# Altium project Submarine.PrjPcb
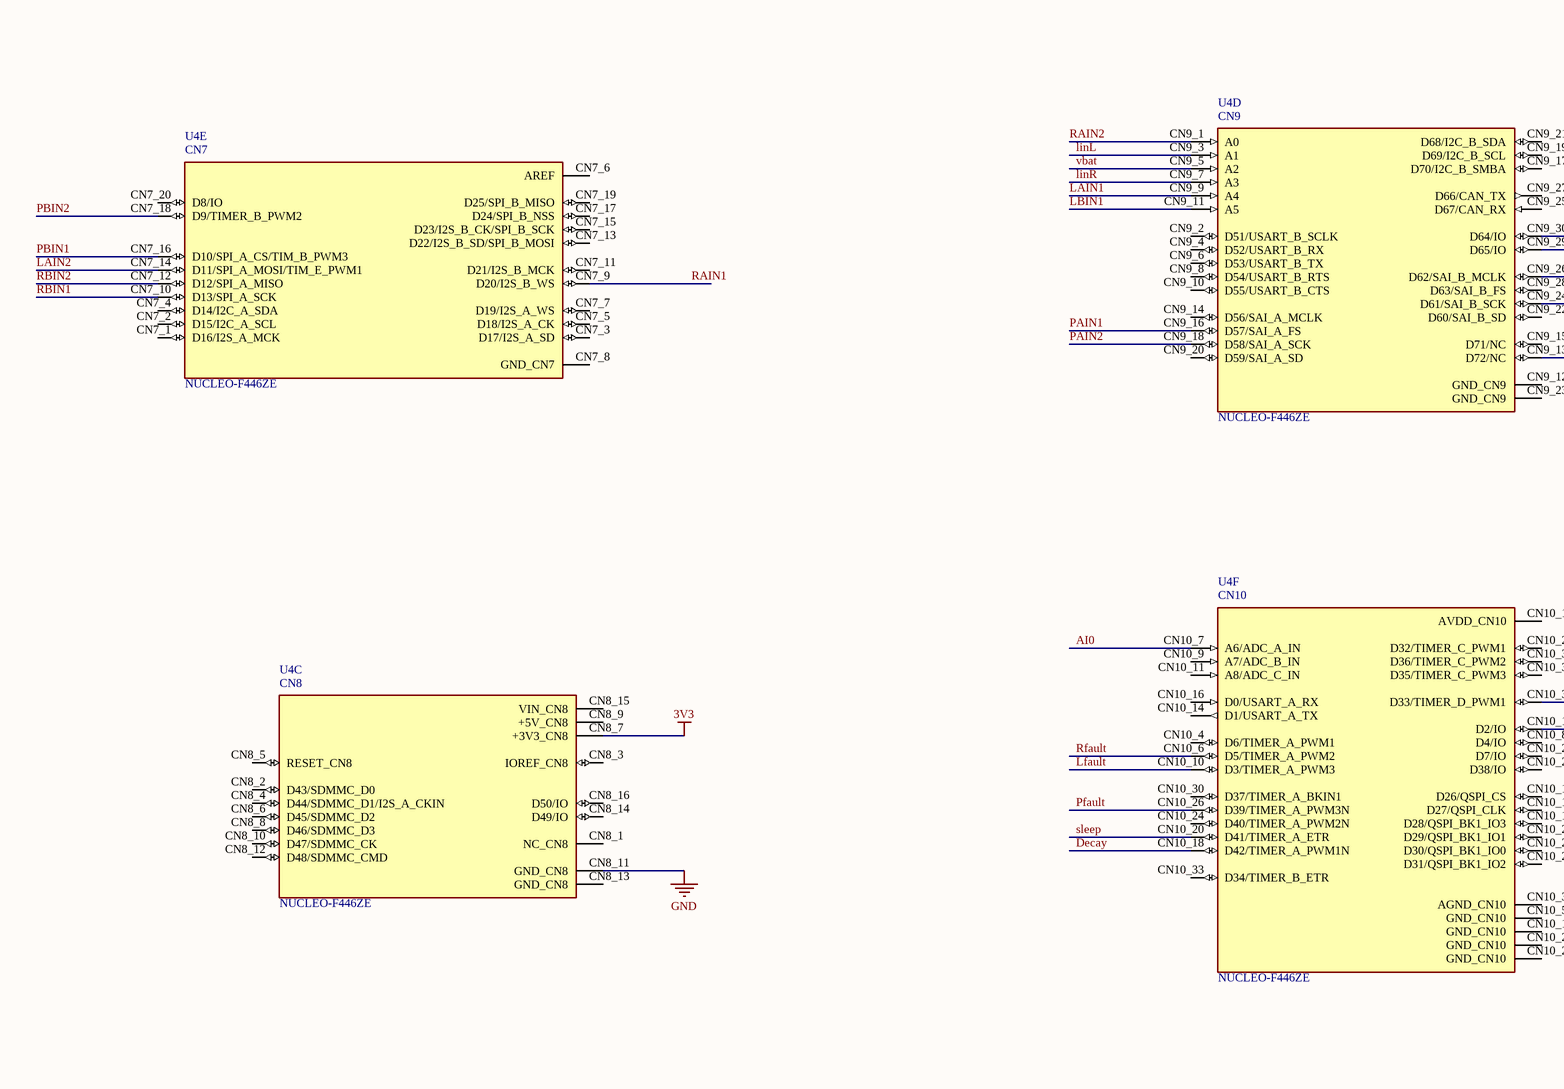
[diagram p0: Submarine.SchDoc, top left]
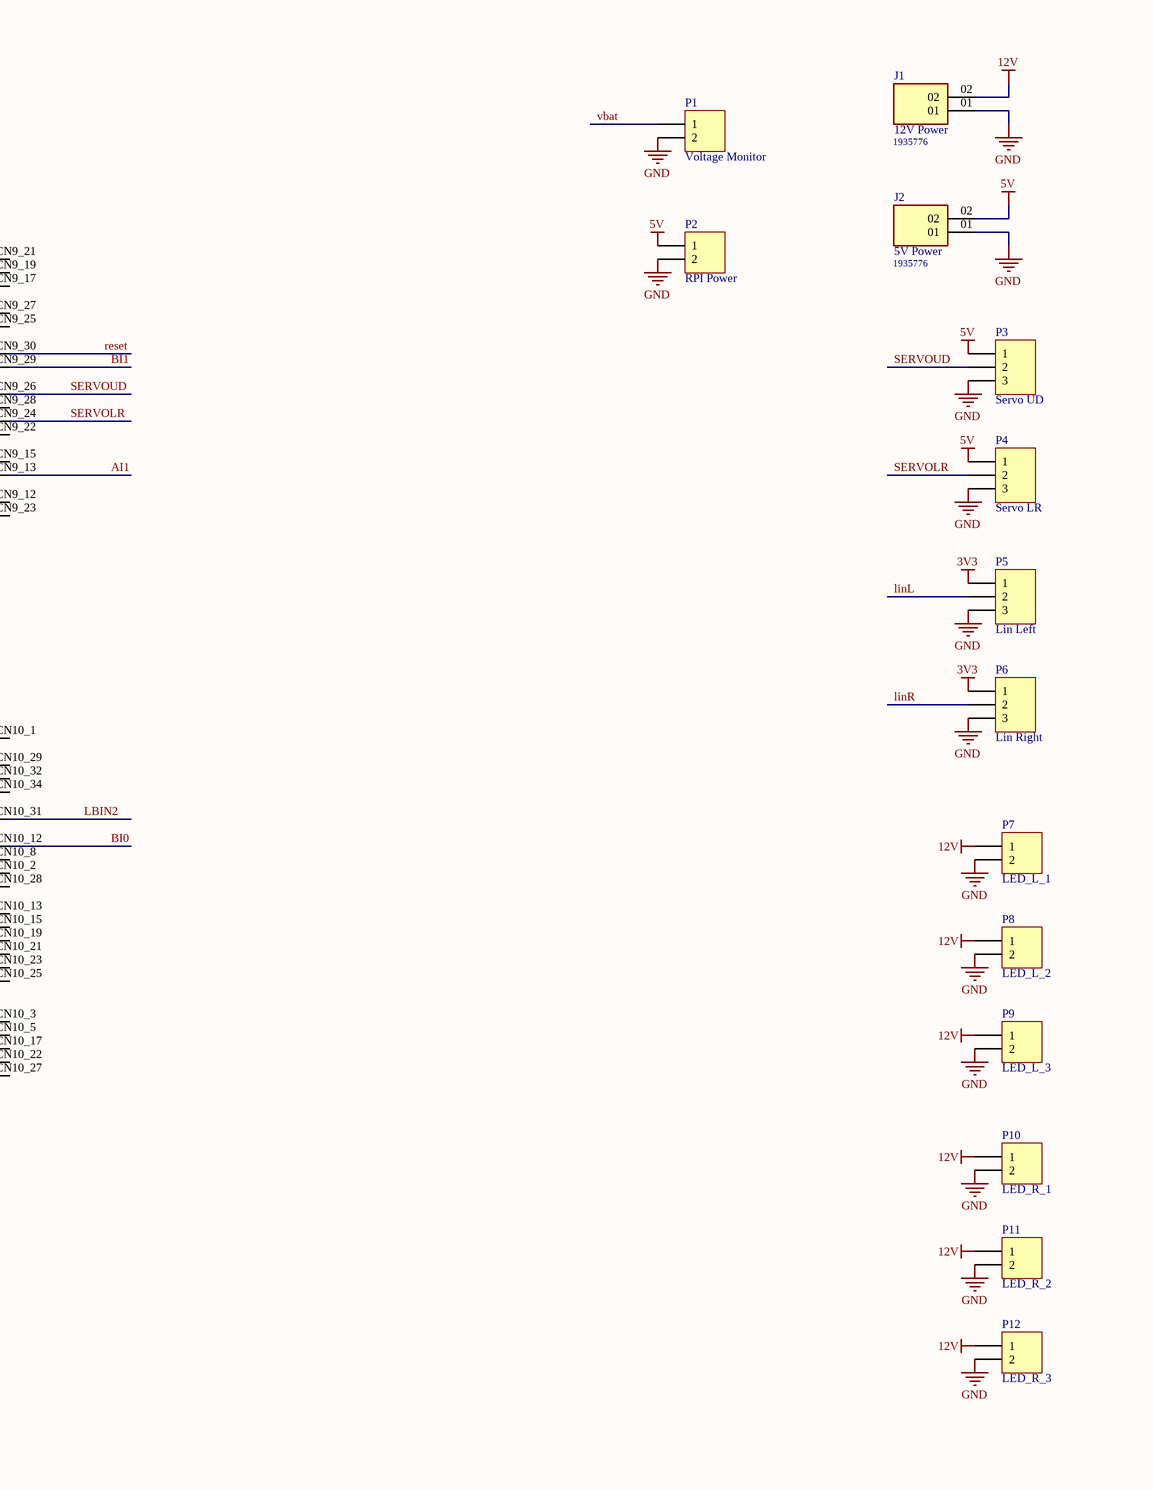
[diagram p1: Submarine.SchDoc, top middle]
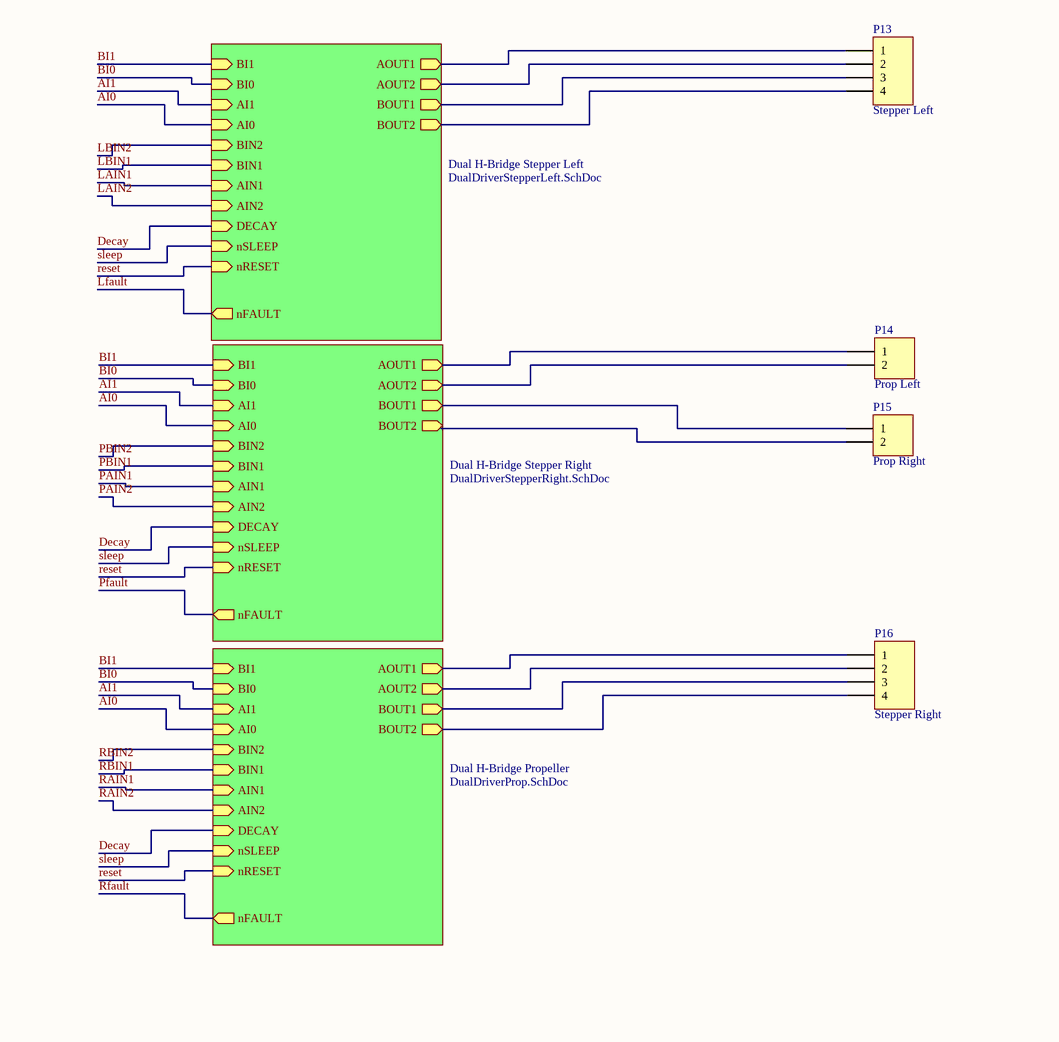
[diagram p2: Submarine.SchDoc, bottom middle]
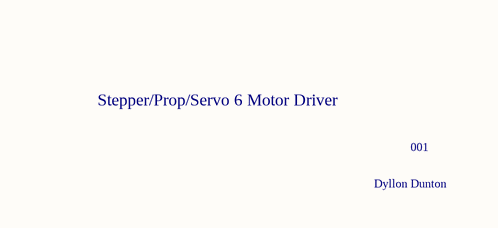
[diagram p3: Submarine.SchDoc, bottom right]
4 sheets, 49 parts. Net scope: hierarchical (ports join the sheet entries above them; power ports are global).
Board file: Submarine.PcbDoc
Sheets:
  Submarine.SchDoc
    Dual H-Bridge Stepper Left = DualDriverStepperLeft.SchDoc
    Dual H-Bridge Stepper Right = DualDriverStepperRight.SchDoc
    Dual H-Bridge Propeller = DualDriverProp.SchDoc

## Sheet Submarine.SchDoc
size E

### Parts
J1  12V Power  [PHOENIX_1935776]
J2  5V Power  [PHOENIX_1935776]
P1  Voltage Monitor  [HDR1X2]
P2  RPI Power  [HDR1X2]
P3  Servo UD  [HDR1X3]
P4  Servo LR  [HDR1X3]
P5  Lin Left  [HDR1X3]
P6  Lin Right  [HDR1X3]
P7  LED_L_1  [HDR1X2]
P8  LED_L_2  [HDR1X2]
P9  LED_L_3  [HDR1X2]
P10  LED_R_1  [HDR1X2]
P11  LED_R_2  [HDR1X2]
P12  LED_R_3  [HDR1X2]
P13  Stepper Left  [HDR1X4]
P14  Prop Left  [HDR1X2]
P15  Prop Right  [HDR1X2]
P16  Stepper Right  [HDR1X4]
U4  NUCLEO-F446ZE  [MODULE_NUCLEO-F446ZE]  (parts C,D,E,F of 6)

### Sub-sheets
Dual H-Bridge Propeller = DualDriverProp.SchDoc: BI1 (in), BI0 (in), AI1 (in), AI0 (in), BIN2 (in), BIN1 (in), AIN1 (in), AIN2 (in), DECAY (in), nSLEEP (in), nRESET (in), nFAULT (out), AOUT1 (out), AOUT2 (out), BOUT1 (out), BOUT2 (out)
Dual H-Bridge Stepper Left = DualDriverStepperLeft.SchDoc: BI1 (in), BI0 (in), AI1 (in), AI0 (in), BIN2 (in), BIN1 (in), AIN1 (in), AIN2 (in), DECAY (in), nSLEEP (in), nRESET (in), nFAULT (out), AOUT1 (out), AOUT2 (out), BOUT1 (out), BOUT2 (out)
Dual H-Bridge Stepper Right = DualDriverStepperRight.SchDoc: BI1 (in), BI0 (in), AI1 (in), AI0 (in), BIN2 (in), BIN1 (in), AIN1 (in), AIN2 (in), DECAY (in), nSLEEP (in), nRESET (in), nFAULT (out), AOUT1 (out), AOUT2 (out), BOUT1 (out), BOUT2 (out)

### Nets
3V3: P5.1 P6.1 U4.CN8_7(+3V3_CN8)
5V: J2.02 P2.1 P3.1 P4.1
12V: J1.02 P7.1 P8.1 P9.1 P10.1 P11.1 P12.1
GND: J1.01 J2.01 P1.2 P2.2 P3.3 P4.3 P5.3 P6.3 P7.2 P8.2 P9.2 P10.2 P11.2 P12.2 U4.CN8_11(GND_CN8)
AI0: U4.CN10_7(A6/ADC_A_IN) ; sheet Dual H-Bridge Stepper Left/AI0, sheet Dual H-Bridge Stepper Right/AI0, sheet Dual H-Bridge Propeller/AI0
AI1: U4.CN9_13(D72/NC) ; sheet Dual H-Bridge Stepper Left/AI1, sheet Dual H-Bridge Stepper Right/AI1, sheet Dual H-Bridge Propeller/AI1
BI0: U4.CN10_12(D2/IO) ; sheet Dual H-Bridge Stepper Left/BI0, sheet Dual H-Bridge Stepper Right/BI0, sheet Dual H-Bridge Propeller/BI0
BI1: U4.CN9_29(D65/IO) ; sheet Dual H-Bridge Stepper Left/BI1, sheet Dual H-Bridge Stepper Right/BI1, sheet Dual H-Bridge Propeller/BI1
Decay: U4.CN10_18(D42/TIMER_A_PWM1N) ; sheet Dual H-Bridge Stepper Left/DECAY, sheet Dual H-Bridge Stepper Right/DECAY, sheet Dual H-Bridge Propeller/DECAY
LAIN1: U4.CN9_9(A4) ; sheet Dual H-Bridge Stepper Left/AIN1
LAIN2: U4.CN7_14(D11/SPI_A_MOSI/TIM_E_PWM1) ; sheet Dual H-Bridge Stepper Left/AIN2
LBIN1: U4.CN9_11(A5) ; sheet Dual H-Bridge Stepper Left/BIN1
LBIN2: U4.CN10_31(D33/TIMER_D_PWM1) ; sheet Dual H-Bridge Stepper Left/BIN2
Lfault: U4.CN10_10(D3/TIMER_A_PWM3) ; sheet Dual H-Bridge Stepper Left/nFAULT
linL: P5.2 U4.CN9_3(A1)
linR: P6.2 U4.CN9_7(A3)
PAIN1: U4.CN9_16(D57/SAI_A_FS) ; sheet Dual H-Bridge Stepper Right/AIN1
PAIN2: U4.CN9_18(D58/SAI_A_SCK) ; sheet Dual H-Bridge Stepper Right/AIN2
PBIN1: U4.CN7_16(D10/SPI_A_CS/TIM_B_PWM3) ; sheet Dual H-Bridge Stepper Right/BIN1
PBIN2: U4.CN7_18(D9/TIMER_B_PWM2) ; sheet Dual H-Bridge Stepper Right/BIN2
Pfault: U4.CN10_26(D39/TIMER_A_PWM3N) ; sheet Dual H-Bridge Stepper Right/nFAULT
RAIN1: U4.CN7_9(D20/I2S_B_WS) ; sheet Dual H-Bridge Propeller/AIN1
RAIN2: U4.CN9_1(A0) ; sheet Dual H-Bridge Propeller/AIN2
RBIN1: U4.CN7_10(D13/SPI_A_SCK) ; sheet Dual H-Bridge Propeller/BIN1
RBIN2: U4.CN7_12(D12/SPI_A_MISO) ; sheet Dual H-Bridge Propeller/BIN2
reset: U4.CN9_30(D64/IO) ; sheet Dual H-Bridge Stepper Left/nRESET, sheet Dual H-Bridge Stepper Right/nRESET, sheet Dual H-Bridge Propeller/nRESET
Rfault: U4.CN10_6(D5/TIMER_A_PWM2) ; sheet Dual H-Bridge Propeller/nFAULT
SERVOLR: P4.2 U4.CN9_24(D61/SAI_B_SCK)
SERVOUD: P3.2 U4.CN9_26(D62/SAI_B_MCLK)
sleep: U4.CN10_20(D41/TIMER_A_ETR) ; sheet Dual H-Bridge Stepper Left/nSLEEP, sheet Dual H-Bridge Stepper Right/nSLEEP, sheet Dual H-Bridge Propeller/nSLEEP
vbat: P1.1 U4.CN9_5(A2)
NetP13_1: P13.1 ; sheet Dual H-Bridge Stepper Left/AOUT1
NetP13_2: P13.2 ; sheet Dual H-Bridge Stepper Left/AOUT2
NetP13_3: P13.3 ; sheet Dual H-Bridge Stepper Left/BOUT1
NetP13_4: P13.4 ; sheet Dual H-Bridge Stepper Left/BOUT2
NetP14_1: P14.1 ; sheet Dual H-Bridge Stepper Right/AOUT1
NetP14_2: P14.2 ; sheet Dual H-Bridge Stepper Right/AOUT2
NetP15_1: P15.1 ; sheet Dual H-Bridge Stepper Right/BOUT1
NetP16_1: P16.1 ; sheet Dual H-Bridge Propeller/AOUT1
NetP16_2: P16.2 ; sheet Dual H-Bridge Propeller/AOUT2
NetP16_3: P16.3 ; sheet Dual H-Bridge Propeller/BOUT1
NetP16_4: P16.4 ; sheet Dual H-Bridge Propeller/BOUT2

Not connected (* = marked no-connect by the designer): P15 2; U4 CN7_1(D16/I2S_A_MCK) CN7_2(D15/I2C_A_SCL) CN7_3(D17/I2S_A_SD) CN7_4(D14/I2C_A_SDA) CN7_5(D18/I2S_A_CK) CN7_6(AREF) CN7_7(D19/I2S_A_WS) CN7_8(GND_CN7) CN7_11(D21/I2S_B_MCK) CN7_13(D22/I2S_B_SD/SPI_B_MOSI) CN7_15(D23/I2S_B_CK/SPI_B_SCK) CN7_17(D24/SPI_B_NSS) CN7_19(D25/SPI_B_MISO) CN7_20(D8/IO) CN8_1(NC_CN8) CN8_2(D43/SDMMC_D0) CN8_3(IOREF_CN8) CN8_4(D44/SDMMC_D1/I2S_A_CKIN) CN8_5(RESET_CN8) CN8_6(D45/SDMMC_D2) CN8_8(D46/SDMMC_D3) CN8_9(+5V_CN8) CN8_10(D47/SDMMC_CK) CN8_12(D48/SDMMC_CMD) CN8_13(GND_CN8) CN8_14(D49/IO) CN8_15(VIN_CN8) CN8_16(D50/IO) CN9_2(D51/USART_B_SCLK) CN9_4(D52/USART_B_RX) CN9_6(D53/USART_B_TX) CN9_8(D54/USART_B_RTS) CN9_10(D55/USART_B_CTS) CN9_12(GND_CN9) CN9_14(D56/SAI_A_MCLK) CN9_15(D71/NC) CN9_17(D70/I2C_B_SMBA) CN9_19(D69/I2C_B_SCL) CN9_20(D59/SAI_A_SD) CN9_21(D68/I2C_B_SDA) CN9_22(D60/SAI_B_SD) CN9_23(GND_CN9) CN9_25(D67/CAN_RX) CN9_27(D66/CAN_TX) CN9_28(D63/SAI_B_FS) CN10_1(AVDD_CN10) CN10_2(D7/IO) CN10_3(AGND_CN10) CN10_4(D6/TIMER_A_PWM1) CN10_5(GND_CN10) CN10_8(D4/IO) CN10_9(A7/ADC_B_IN) CN10_11(A8/ADC_C_IN) CN10_13(D26/QSPI_CS) CN10_14(D1/USART_A_TX) CN10_15(D27/QSPI_CLK) CN10_16(D0/USART_A_RX) CN10_17(GND_CN10) CN10_19(D28/QSPI_BK1_IO3) CN10_21(D29/QSPI_BK1_IO1) CN10_22(GND_CN10) CN10_23(D30/QSPI_BK1_IO0) CN10_24(D40/TIMER_A_PWM2N) CN10_25(D31/QSPI_BK1_IO2) CN10_27(GND_CN10) CN10_28(D38/IO) CN10_29(D32/TIMER_C_PWM1) CN10_30(D37/TIMER_A_BKIN1) CN10_32(D36/TIMER_C_PWM2) CN10_33(D34/TIMER_B_ETR) CN10_34(D35/TIMER_C_PWM3)

### Notes on the sheet
- (near J1) 1935776
- (near J2) 1935776
- Stepper/Prop/Servo 6 Motor Driver
- Dyllon Dunton
- 001
- (in symbol NUCLEO-F446ZE, part C) CN8
- (in symbol NUCLEO-F446ZE, part D) CN9
- (in symbol NUCLEO-F446ZE, part E) CN7
- (in symbol NUCLEO-F446ZE, part F) CN10

### Library data of the parts
J1 J2 = 1935776: Package: None; MP: 1935776; Availability: Unavailable; Price: None; Value: *
P1 P2 P7-P12 P14 P15 = Header 2: Header, 2-Pin; LatestRevisionDate: 17-Jul-2002; LatestRevisionNote: Re-released for DXP Platform.; Publisher: Altium Limited
P3-P6 = Header 3: Header, 3-Pin; LatestRevisionDate: 17-Jul-2002; LatestRevisionNote: Re-released for DXP Platform.; Publisher: Altium Limited
P13 P16 = Header 4: Header, 4-Pin; LatestRevisionDate: 17-Jul-2002; LatestRevisionNote: Re-released for DXP Platform.; Publisher: Altium Limited
U4 = NUCLEO-F446ZE: STM32F446ZE, mbed-Enabled Development Nucleo-144 STM32F4 ARMÂ® CortexÂ®-M4 MCU 32-Bit Embedded Evaluation Board; MF: STMicroelectronics; MP: NUCLEO-F446ZE; Value: *; Check_prices: https://www.snapeda.com/parts/NUCLEO-F446ZE/STMicroelectronics/view-part/?ref=eda; Package: None; Price: None; Availability: In Stock; Purchase-URL: https://pricing.snapeda.com/search/part/NUCLEO-F446ZE/?ref=eda; SnapEDA_Link: https://www.snapeda.com/parts/NUCLEO-F446ZE/STMicroelectronics/view-part/?ref=snap

## Sheet DualDriverStepperLeft.SchDoc
size A
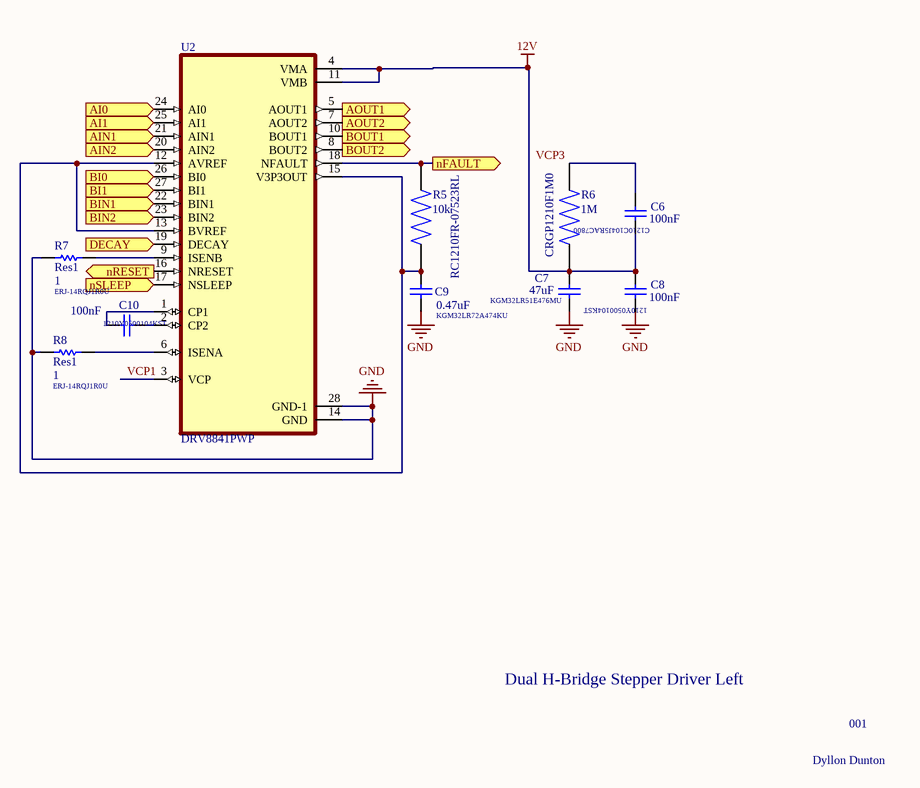
[diagram p4: DualDriverStepperLeft.SchDoc]

### Parts
C6  value 100nF  [C1210]  (hidden comment: Cap)
C7  value 47uF  [C1210]  (hidden comment: Cap)
C8  value 100nF  [C1210]  (hidden comment: Cap)
C9  value 0.47uF  [C1210]  (hidden comment: Cap)
C10  value 100nF  [C1210]  (hidden comment: Cap)
R5  RC1210FR-07523RL  value 10k  [RESC3126X65N]
R6  CRGP1210F1M0  value 1M  [RESC3126X65N]
R7  Res1  value 1  [RES_ERJ14RQJ1R0U]
R8  Res1  value 1  [RES_ERJ14RQJ1R0U]
U2  DRV8841PWP  [IC_TPS61196PWPRQ1]

### Ports
AI0 (in), AI1 (in), AIN1 (in), AIN2 (in), AOUT1 (out), AOUT2 (out), BI0 (in), BI1 (in), BIN1 (in), BIN2 (in), BOUT1 (out), BOUT2 (out), DECAY (in), nFAULT (out), nRESET (in), nSLEEP (in)

### Nets
12V: C6.2 C7.2 C8.1 R6.1 U2.4(VMA) U2.11(VMB)
GND: C7.1 C8.2 C9.1 R7.1 R8.1 U2.14(GND) U2.28(GND-1)
AI0: U2.24(AI0) ; port AI0
AI1: U2.25(AI1) ; port AI1
BI0: U2.26(BI0) ; port BI0
BI1: U2.27(BI1) ; port BI1
Decay: U2.19(DECAY) ; port DECAY
LAIN1: U2.21(AIN1) ; port AIN1
LAIN2: U2.20(AIN2) ; port AIN2
LBIN1: U2.22(BIN1) ; port BIN1
LBIN2: U2.23(BIN2) ; port BIN2
Lfault: R5.2 U2.18(NFAULT) ; port nFAULT
reset: U2.16(NRESET) ; port nRESET
sleep: U2.17(NSLEEP) ; port nSLEEP
VCP1: U2.3(VCP)
NetC6_1: C6.1 R6.2
NetC9_2: C9.2 R5.1 U2.12(AVREF) U2.13(BVREF) U2.15(V3P3OUT)
NetC10_1: C10.1 U2.2(CP2)
NetC10_2: C10.2 U2.1(CP1)
NetP13_1: U2.5(AOUT1) ; port AOUT1
NetP13_2: U2.7(AOUT2) ; port AOUT2
NetP13_3: U2.10(BOUT1) ; port BOUT1
NetP13_4: U2.8(BOUT2) ; port BOUT2
NetR7_2: R7.2 U2.9(ISENB)
NetR8_2: R8.2 U2.6(ISENA)

### Notes on the sheet
- (near C6) C1210C104J5RAC7800
- ERJ-14RQJ1R0U
- 1210Y0500104KST
- (near C9) KGM32LR72A474KU
- (near C7) KGM32LR51E476MU
- (near C8) 1210Y0500104KST
- (near R8) ERJ-14RQJ1R0U
- Dual H-Bridge Stepper Driver Left
- 001
- Dyllon Dunton
- Labels drawn without touching a wire or pin: VCP3

### Library data of the parts
C6-C10 = Cap: Capacitor; Published: 8-Jun-2000; LatestRevisionDate: 17-Jul-2002; LatestRevisionNote: Re-released for DXP Platform.; PackageReference: RAD-0.3; Publisher: Altium Limited; PackageDescription: Radial Cap, Thru-Hole; 2 Leads; 0.3 in Pin Spacing
R5 R6 = RC1210FR-07523RL: 523 Ohms Â±1% 0.5W, 1/2W Chip Resistor 1210 _3225 Metric_ Moisture Resistant Thick Film; MF: Yageo; Package: 3126 Yageo; Availability: Unavailable; MP: RC1210FR-07523RL; SnapEDA_Link: https://www.snapeda.com/parts/RC1210FR-07523RL/Yageo/view-part/1091979/?ref=snap; Price: None
R7 R8 = Res1: Resistor; Published: 8-Jun-2000; LatestRevisionDate: 17-Jul-2002; LatestRevisionNote: Re-released for DXP Platform.; PackageReference: AXIAL-0.3; Publisher: Altium Limited; PackageDescription: Axial Device, Thru-Hole; 2 Leads; 0.3 in Pin Spacing
U2 = DRV8841PWP: 45-V, 2.5-A bipolar stepper or dual H-bridge motor driver IC with current regulation and PWM control; MF: Texas Instruments; Value: *; SnapEDA_Link: https://www.snapeda.com/parts/DRV8841PWP/Texas+Instruments/view-part/?ref=snap; Check_prices: https://www.snapeda.com/parts/DRV8841PWP/Texas+Instruments/view-part/?ref=eda; Purchase-URL: https://pricing.snapeda.com/search/part/DRV8841PWP/?ref=eda; Availability: In Stock; Price: None; Package: HTSSOP-28 Texas Instruments; MP: DRV8841PWP

## Sheet DualDriverStepperRight.SchDoc
size A
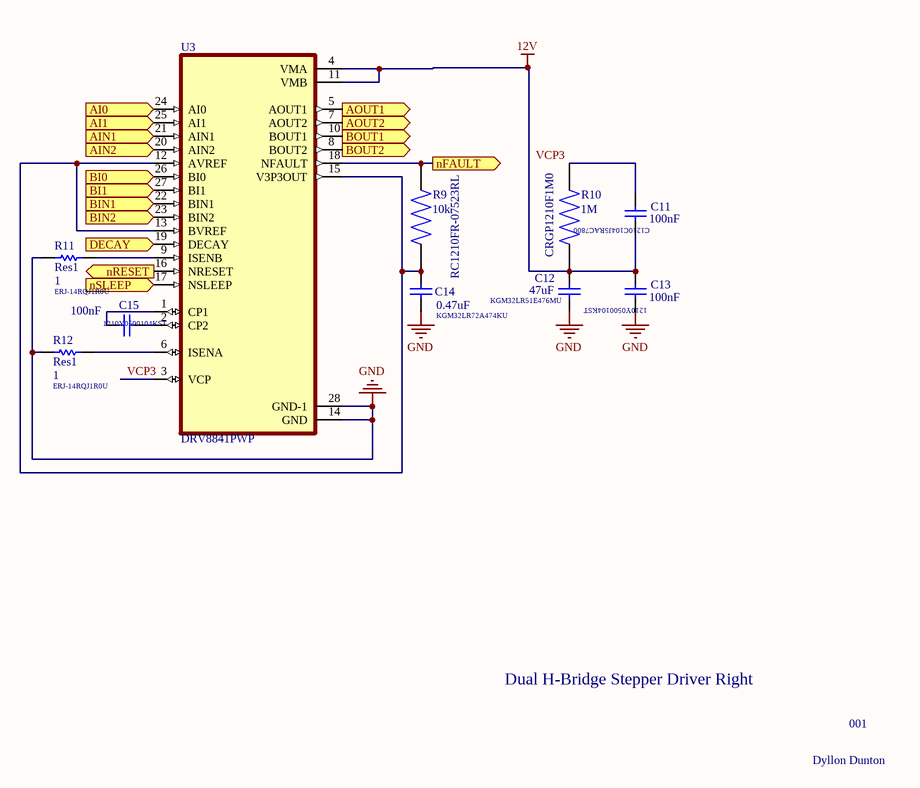
[diagram p5: DualDriverStepperRight.SchDoc]

### Parts
C11  value 100nF  [C1210]  (hidden comment: Cap)
C12  value 47uF  [C1210]  (hidden comment: Cap)
C13  value 100nF  [C1210]  (hidden comment: Cap)
C14  value 0.47uF  [C1210]  (hidden comment: Cap)
C15  value 100nF  [C1210]  (hidden comment: Cap)
R9  RC1210FR-07523RL  value 10k  [RESC3126X65N]
R10  CRGP1210F1M0  value 1M  [RESC3126X65N]
R11  Res1  value 1  [RES_ERJ14RQJ1R0U]
R12  Res1  value 1  [RES_ERJ14RQJ1R0U]
U3  DRV8841PWP  [IC_TPS61196PWPRQ1]

### Ports
AI0 (in), AI1 (in), AIN1 (in), AIN2 (in), AOUT1 (out), AOUT2 (out), BI0 (in), BI1 (in), BIN1 (in), BIN2 (in), BOUT1 (out), BOUT2 (out), DECAY (in), nFAULT (out), nRESET (in), nSLEEP (in)

### Nets
12V: C11.2 C12.2 C13.1 R10.1 U3.4(VMA) U3.11(VMB)
GND: C12.1 C13.2 C14.1 R11.1 R12.1 U3.14(GND) U3.28(GND-1)
AI0: U3.24(AI0) ; port AI0
AI1: U3.25(AI1) ; port AI1
BI0: U3.26(BI0) ; port BI0
BI1: U3.27(BI1) ; port BI1
Decay: U3.19(DECAY) ; port DECAY
PAIN1: U3.21(AIN1) ; port AIN1
PAIN2: U3.20(AIN2) ; port AIN2
PBIN1: U3.22(BIN1) ; port BIN1
PBIN2: U3.23(BIN2) ; port BIN2
Pfault: R9.2 U3.18(NFAULT) ; port nFAULT
reset: U3.16(NRESET) ; port nRESET
sleep: U3.17(NSLEEP) ; port nSLEEP
VCP3: U3.3(VCP)
NetC11_1: C11.1 R10.2
NetC14_2: C14.2 R9.1 U3.12(AVREF) U3.13(BVREF) U3.15(V3P3OUT)
NetC15_1: C15.1 U3.2(CP2)
NetC15_2: C15.2 U3.1(CP1)
NetP14_1: U3.5(AOUT1) ; port AOUT1
NetP14_2: U3.7(AOUT2) ; port AOUT2
NetP15_1: U3.10(BOUT1) ; port BOUT1
NetR11_2: R11.2 U3.9(ISENB)
NetR12_2: R12.2 U3.6(ISENA)
NetU3_8: U3.8(BOUT2) ; port BOUT2

### Notes on the sheet
- (near C11) C1210C104J5RAC7800
- ERJ-14RQJ1R0U
- 1210Y0500104KST
- (near C14) KGM32LR72A474KU
- (near C12) KGM32LR51E476MU
- (near C13) 1210Y0500104KST
- (near R12) ERJ-14RQJ1R0U
- Dual H-Bridge Stepper Driver Right
- 001
- Dyllon Dunton
- Labels drawn without touching a wire or pin: VCP3

### Library data of the parts
C11-C15 = Cap: Capacitor; Published: 8-Jun-2000; LatestRevisionDate: 17-Jul-2002; LatestRevisionNote: Re-released for DXP Platform.; PackageReference: RAD-0.3; Publisher: Altium Limited; PackageDescription: Radial Cap, Thru-Hole; 2 Leads; 0.3 in Pin Spacing
R9 R10 = RC1210FR-07523RL: as R5 on sheet DualDriverStepperLeft; Package: 3126 Yageo; Availability: Unavailable; MP: RC1210FR-07523RL; SnapEDA_Link: https://www.snapeda.com/parts/RC1210FR-07523RL/Yageo/view-part/1091979/?ref=snap; Price: None
R11 R12 = Res1: Resistor; Published: 8-Jun-2000; LatestRevisionDate: 17-Jul-2002; LatestRevisionNote: Re-released for DXP Platform.; PackageReference: AXIAL-0.3; Publisher: Altium Limited; PackageDescription: Axial Device, Thru-Hole; 2 Leads; 0.3 in Pin Spacing
U3 = DRV8841PWP: as U2 on sheet DualDriverStepperLeft; Value: *; SnapEDA_Link: https://www.snapeda.com/parts/DRV8841PWP/Texas+Instruments/view-part/?ref=snap; Check_prices: https://www.snapeda.com/parts/DRV8841PWP/Texas+Instruments/view-part/?ref=eda; Purchase-URL: https://pricing.snapeda.com/search/part/DRV8841PWP/?ref=eda; Availability: In Stock; Price: None; Package: HTSSOP-28 Texas Instruments; MP: DRV8841PWP

## Sheet DualDriverProp.SchDoc
size A
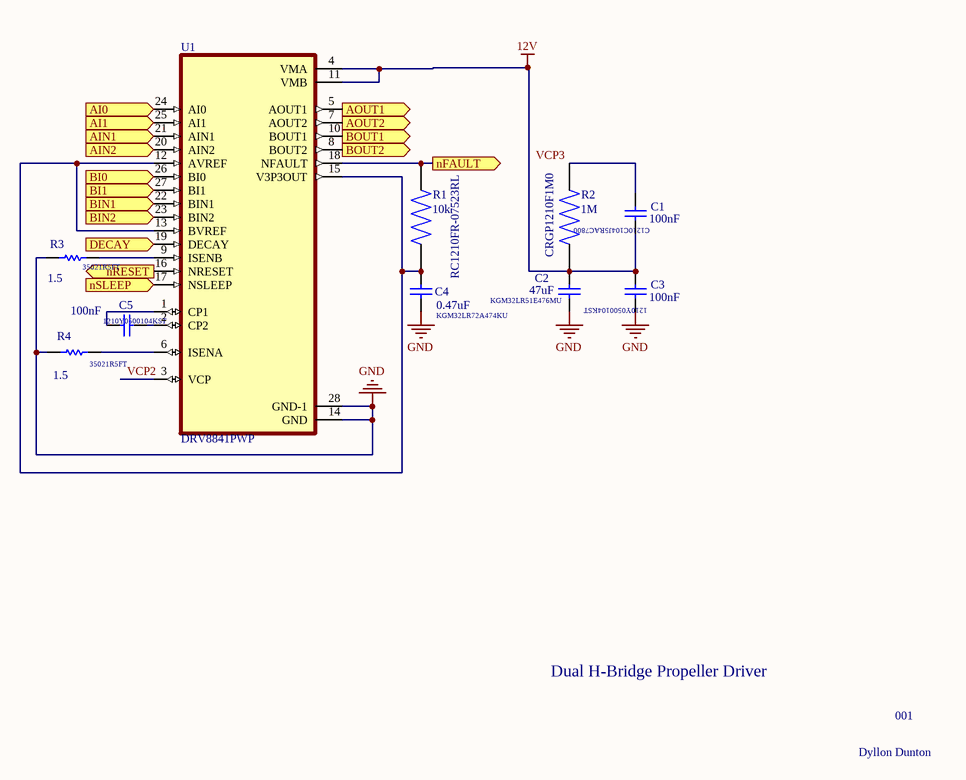
[diagram p6: DualDriverProp.SchDoc]

### Parts
C1  value 100nF  [C1210]  (hidden comment: Cap)
C2  value 47uF  [C1210]  (hidden comment: Cap)
C3  value 100nF  [C1210]  (hidden comment: Cap)
C4  value 0.47uF  [C1210]  (hidden comment: Cap)
C5  value 100nF  [C1210]  (hidden comment: Cap)
R1  RC1210FR-07523RL  value 10k  [RESC3126X65N]
R2  CRGP1210F1M0  value 1M  [RESC3126X65N]
R3  value 1.5  [RESC5025X70N]  (hidden comment: Res1)
R4  value 1.5  [RESC5025X70N]  (hidden comment: Res1)
U1  DRV8841PWP  [IC_TPS61196PWPRQ1]

### Ports
AI0 (in), AI1 (in), AIN1 (in), AIN2 (in), AOUT1 (out), AOUT2 (out), BI0 (in), BI1 (in), BIN1 (in), BIN2 (in), BOUT1 (out), BOUT2 (out), DECAY (in), nFAULT (out), nRESET (in), nSLEEP (in)

### Nets
12V: C1.2 C2.2 C3.1 R2.1 U1.4(VMA) U1.11(VMB)
GND: C2.1 C3.2 C4.1 R3.1 R4.1 U1.14(GND) U1.28(GND-1)
AI0: U1.24(AI0) ; port AI0
AI1: U1.25(AI1) ; port AI1
BI0: U1.26(BI0) ; port BI0
BI1: U1.27(BI1) ; port BI1
Decay: U1.19(DECAY) ; port DECAY
RAIN1: U1.21(AIN1) ; port AIN1
RAIN2: U1.20(AIN2) ; port AIN2
RBIN1: U1.22(BIN1) ; port BIN1
RBIN2: U1.23(BIN2) ; port BIN2
reset: U1.16(NRESET) ; port nRESET
Rfault: R1.2 U1.18(NFAULT) ; port nFAULT
sleep: U1.17(NSLEEP) ; port nSLEEP
VCP2: U1.3(VCP)
NetC1_1: C1.1 R2.2
NetC4_2: C4.2 R1.1 U1.12(AVREF) U1.13(BVREF) U1.15(V3P3OUT)
NetC5_1: C5.1 U1.2(CP2)
NetC5_2: C5.2 U1.1(CP1)
NetP16_1: U1.5(AOUT1) ; port AOUT1
NetP16_2: U1.7(AOUT2) ; port AOUT2
NetP16_3: U1.10(BOUT1) ; port BOUT1
NetP16_4: U1.8(BOUT2) ; port BOUT2
NetR3_2: R3.2 U1.9(ISENB)
NetR4_2: R4.2 U1.6(ISENA)

### Notes on the sheet
- (near R3) 35021R5FT
- (near C1) C1210C104J5RAC7800
- 1210Y0500104KST
- (near C4) KGM32LR72A474KU
- (near C2) KGM32LR51E476MU
- (near C3) 1210Y0500104KST
- (near R4) 35021R5FT
- Dual H-Bridge Propeller Driver
- 001
- Dyllon Dunton
- Labels drawn without touching a wire or pin: VCP3

### Library data of the parts
C1-C5 = Cap: Capacitor; Published: 8-Jun-2000; LatestRevisionDate: 17-Jul-2002; LatestRevisionNote: Re-released for DXP Platform.; PackageReference: RAD-0.3; Publisher: Altium Limited; PackageDescription: Radial Cap, Thru-Hole; 2 Leads; 0.3 in Pin Spacing
R1 R2 = RC1210FR-07523RL: as R5 on sheet DualDriverStepperLeft; Package: 3126 Yageo; Availability: Unavailable; MP: RC1210FR-07523RL; SnapEDA_Link: https://www.snapeda.com/parts/RC1210FR-07523RL/Yageo/view-part/1091979/?ref=snap; Price: None
R3 R4 = Res1: Resistor; Published: 8-Jun-2000; LatestRevisionDate: 17-Jul-2002; LatestRevisionNote: Re-released for DXP Platform.; PackageReference: AXIAL-0.3; Publisher: Altium Limited; PackageDescription: Axial Device, Thru-Hole; 2 Leads; 0.3 in Pin Spacing
U1 = DRV8841PWP: as U2 on sheet DualDriverStepperLeft; Value: *; SnapEDA_Link: https://www.snapeda.com/parts/DRV8841PWP/Texas+Instruments/view-part/?ref=snap; Check_prices: https://www.snapeda.com/parts/DRV8841PWP/Texas+Instruments/view-part/?ref=eda; Purchase-URL: https://pricing.snapeda.com/search/part/DRV8841PWP/?ref=eda; Availability: In Stock; Price: None; Package: HTSSOP-28 Texas Instruments; MP: DRV8841PWP

## Nets that join several sheets
12V: Submarine (7 pins), DualDriverStepperLeft (6 pins), DualDriverStepperRight (6 pins), DualDriverProp (6 pins)
GND: Submarine (15 pins), DualDriverStepperLeft (7 pins), DualDriverStepperRight (7 pins), DualDriverProp (7 pins)
AI0: Submarine (U4.CN10_7), DualDriverStepperLeft (U2.24), DualDriverStepperRight (U3.24), DualDriverProp (U1.24)
AI1: Submarine (U4.CN9_13), DualDriverStepperLeft (U2.25), DualDriverStepperRight (U3.25), DualDriverProp (U1.25)
BI0: Submarine (U4.CN10_12), DualDriverStepperLeft (U2.26), DualDriverStepperRight (U3.26), DualDriverProp (U1.26)
BI1: Submarine (U4.CN9_29), DualDriverStepperLeft (U2.27), DualDriverStepperRight (U3.27), DualDriverProp (U1.27)
Decay: Submarine (U4.CN10_18), DualDriverStepperLeft (U2.19), DualDriverStepperRight (U3.19), DualDriverProp (U1.19)
LAIN1: Submarine (U4.CN9_9), DualDriverStepperLeft (U2.21)
LAIN2: Submarine (U4.CN7_14), DualDriverStepperLeft (U2.20)
LBIN1: Submarine (U4.CN9_11), DualDriverStepperLeft (U2.22)
LBIN2: Submarine (U4.CN10_31), DualDriverStepperLeft (U2.23)
Lfault: Submarine (U4.CN10_10), DualDriverStepperLeft (R5.2 U2.18)
NetP13_1: Submarine (P13.1), DualDriverStepperLeft (U2.5)
NetP13_2: Submarine (P13.2), DualDriverStepperLeft (U2.7)
NetP13_3: Submarine (P13.3), DualDriverStepperLeft (U2.10)
NetP13_4: Submarine (P13.4), DualDriverStepperLeft (U2.8)
NetP14_1: Submarine (P14.1), DualDriverStepperRight (U3.5)
NetP14_2: Submarine (P14.2), DualDriverStepperRight (U3.7)
NetP15_1: Submarine (P15.1), DualDriverStepperRight (U3.10)
NetP16_1: Submarine (P16.1), DualDriverProp (U1.5)
NetP16_2: Submarine (P16.2), DualDriverProp (U1.7)
NetP16_3: Submarine (P16.3), DualDriverProp (U1.10)
NetP16_4: Submarine (P16.4), DualDriverProp (U1.8)
PAIN1: Submarine (U4.CN9_16), DualDriverStepperRight (U3.21)
PAIN2: Submarine (U4.CN9_18), DualDriverStepperRight (U3.20)
PBIN1: Submarine (U4.CN7_16), DualDriverStepperRight (U3.22)
PBIN2: Submarine (U4.CN7_18), DualDriverStepperRight (U3.23)
Pfault: Submarine (U4.CN10_26), DualDriverStepperRight (R9.2 U3.18)
RAIN1: Submarine (U4.CN7_9), DualDriverProp (U1.21)
RAIN2: Submarine (U4.CN9_1), DualDriverProp (U1.20)
RBIN1: Submarine (U4.CN7_10), DualDriverProp (U1.22)
RBIN2: Submarine (U4.CN7_12), DualDriverProp (U1.23)
reset: Submarine (U4.CN9_30), DualDriverStepperLeft (U2.16), DualDriverStepperRight (U3.16), DualDriverProp (U1.16)
Rfault: Submarine (U4.CN10_6), DualDriverProp (R1.2 U1.18)
sleep: Submarine (U4.CN10_20), DualDriverStepperLeft (U2.17), DualDriverStepperRight (U3.17), DualDriverProp (U1.17)